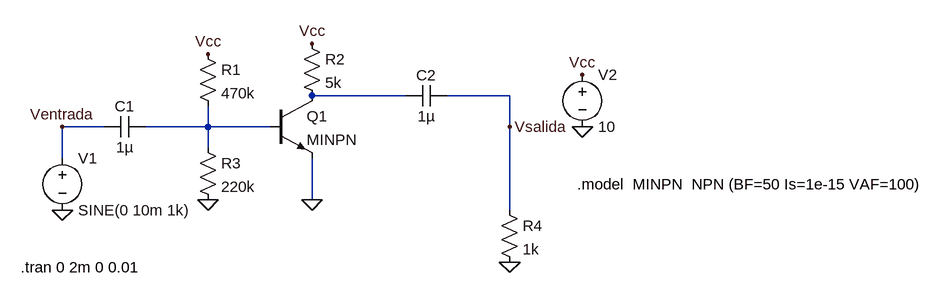
[diagram p0: schematic circuitocontransistor.asc]
circuitocontransistor.asc, the LTspice schematic file:
Version 4
SHEET 1 1480 680
WIRE 608 16 464 16
WIRE 768 16 672 16
WIRE 144 64 80 64
WIRE 304 64 304 32
WIRE 304 64 208 64
WIRE 400 64 304 64
WIRE 768 64 768 16
WIRE 304 96 304 64
WIRE 80 112 80 64
WIRE 464 176 464 112
WIRE 768 192 768 64
FLAG 464 176 0
FLAG 304 176 0
FLAG 80 192 0
FLAG 768 272 0
FLAG 880 64 0
FLAG 880 -16 Vcc
FLAG 304 -48 Vcc
FLAG 464 -64 Vcc
FLAG 80 64 Ventrada
FLAG 768 64 Vsalida
SYMBOL voltage 80 96 R0
WINDOW 123 0 0 Left 2
WINDOW 39 0 0 Left 2
SYMATTR InstName V1
SYMATTR Value SINE(0 10m 1k)
SYMBOL cap 208 48 R90
WINDOW 0 0 32 VBottom 2
WINDOW 3 32 32 VTop 2
SYMATTR InstName C1
SYMATTR Value 1µ
SYMBOL res 288 -64 R0
SYMATTR InstName R1
SYMATTR Value 470k
SYMBOL res 448 -80 R0
SYMATTR InstName R2
SYMATTR Value 5k
SYMBOL npn 400 16 R0
SYMATTR InstName Q1
SYMATTR Value MINPN
SYMBOL res 288 80 R0
SYMATTR InstName R3
SYMATTR Value 220k
SYMBOL cap 672 0 R90
WINDOW 0 0 32 VBottom 2
WINDOW 3 32 32 VTop 2
SYMATTR InstName C2
SYMATTR Value 1µ
SYMBOL res 752 176 R0
SYMATTR InstName R4
SYMATTR Value 1k
SYMBOL voltage 880 -32 R0
SYMATTR InstName V2
SYMATTR Value 10
TEXT 16 280 Left 2 !.tran 0 2m 0 0.01
TEXT 872 152 Left 2 !.model  MINPN  NPN (BF=50 Is=1e-15 VAF=100)

The netlist it stands for:
* circuitocontransistor.asc
V1 Ventrada 0 SINE(0 10m 1k)
C1 N002 Ventrada 1µ
R1 Vcc N002 470k
R2 Vcc N001 5k
Q1 N001 N002 0 0 MINPN
R3 N002 0 220k
C2 Vsalida N001 1µ
R4 Vsalida 0 1k
V2 Vcc 0 10
.model NPN NPN
.model PNP PNP
.lib standard.bjt
.tran 0 2m 0 0.01
.model  MINPN  NPN (BF=50 Is=1e-15 VAF=100)
.backanno
.end